# Altium schematic sheet TP2_ESP8266.SchDoc: Leonardo
size 300 x 200 mm; SheetNumber: 1; SheetTotal: 6
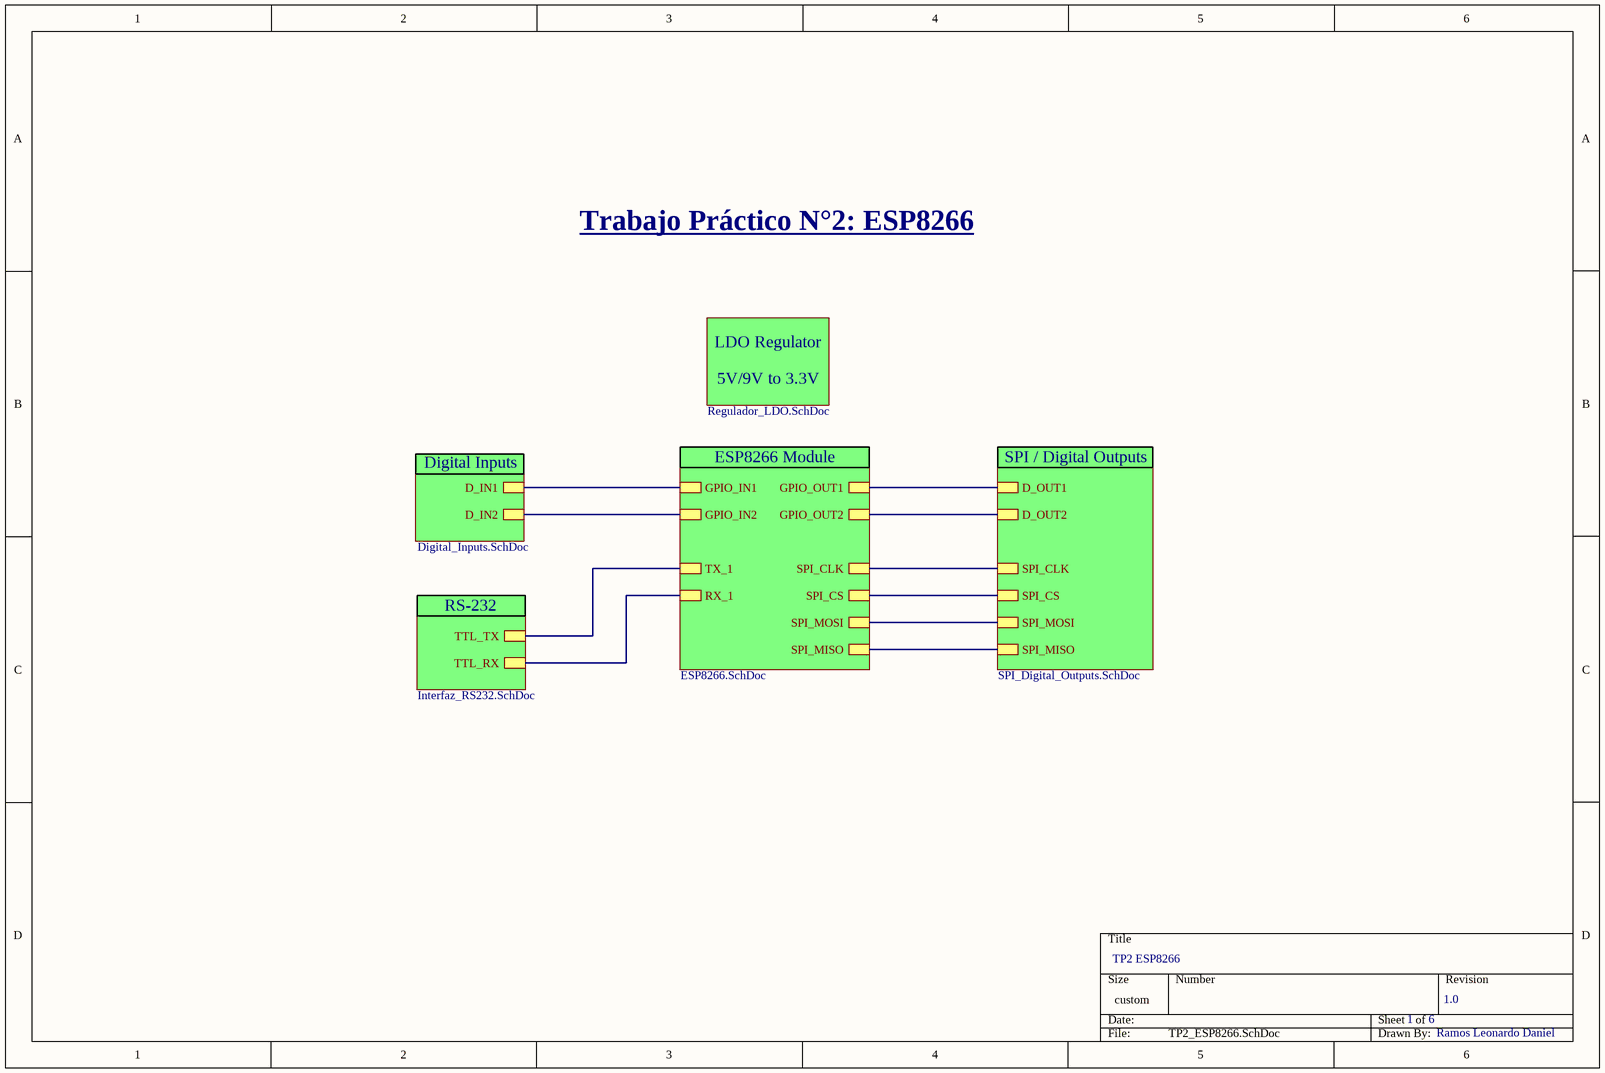
[diagram p0: TP2_ESP8266.SchDoc]

## Sub-sheets
Digital Inputs = Digital_Inputs.SchDoc: D_IN1, D_IN2
ESP8266 = ESP8266.SchDoc: TX_1, RX_1, SPI_CLK, SPI_CS, SPI_MISO, SPI_MOSI, GPIO_IN1, GPIO_IN2, GPIO_OUT1, GPIO_OUT2
Regulador LDO = Regulador_LDO.SchDoc: no entries
RS-232 = Interfaz_RS232.SchDoc: TTL_TX, TTL_RX
SPI/ Digital_Outputs = SPI_Digital_Outputs.SchDoc: D_OUT1, D_OUT2, SPI_CLK, SPI_CS, SPI_MOSI, SPI_MISO

## Nets
(unnamed): sheet RS-232/TTL_TX, sheet ESP8266/TX_1
(unnamed): sheet RS-232/TTL_RX, sheet ESP8266/RX_1
(unnamed): sheet Digital Inputs/D_IN1, sheet ESP8266/GPIO_IN1
(unnamed): sheet Digital Inputs/D_IN2, sheet ESP8266/GPIO_IN2
(unnamed): sheet SPI/ Digital_Outputs/D_OUT1, sheet ESP8266/GPIO_OUT1
(unnamed): sheet SPI/ Digital_Outputs/D_OUT2, sheet ESP8266/GPIO_OUT2
(unnamed): sheet SPI/ Digital_Outputs/SPI_CLK, sheet ESP8266/SPI_CLK
(unnamed): sheet SPI/ Digital_Outputs/SPI_CS, sheet ESP8266/SPI_CS
(unnamed): sheet SPI/ Digital_Outputs/SPI_MOSI, sheet ESP8266/SPI_MOSI
(unnamed): sheet SPI/ Digital_Outputs/SPI_MISO, sheet ESP8266/SPI_MISO

## Notes on the sheet
- Trabajo Práctico N°2: ESP8266
- LDO Regulator
- 5V/9V to 3.3V
- Digital Inputs
- ESP8266 Module
- SPI / Digital Outputs
- RS-232
- TP2 ESP8266
- 1
- 6
- 1.0
- Ramos Leonardo Daniel